# EAGLE schematic ProyectoFinal (EAGLE 9.4.0)
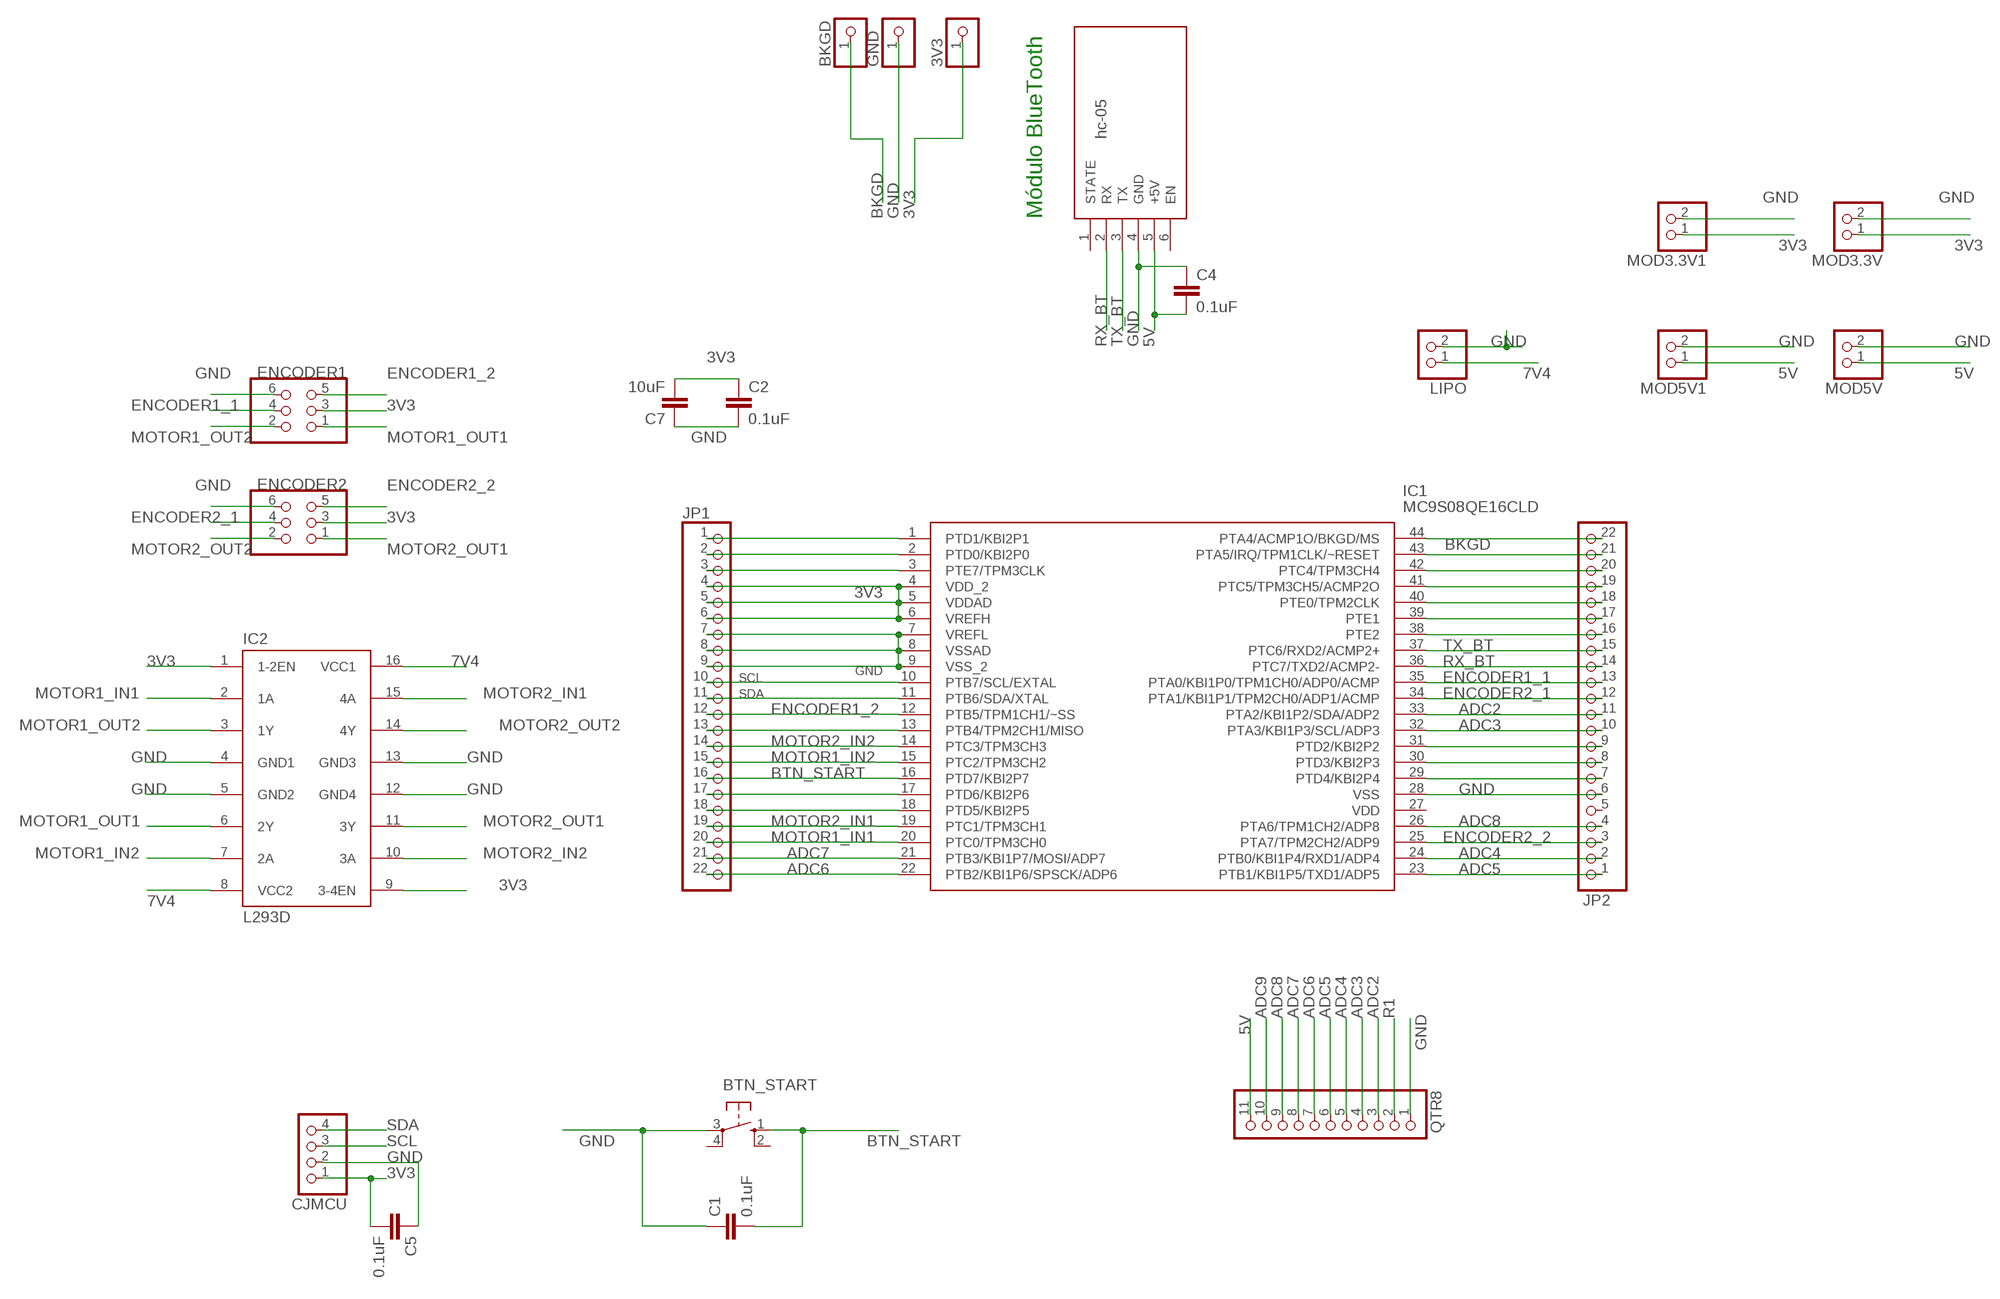
[diagram p0: schematic, sheet 1]

## Parts
3V3  PINHD-1X1  [1X01]
BKGD  PINHD-1X1  [1X01]
BLUETOOTH  hc-05  WIRELESS-BLUETOOTH-HC-05  [WIRELESS-BLUETOOTH-HC-05]
BTN_START  10-XX  [B3F-10XX]
C1  0.1uF  C-EUC0805K  [C0805K]
C2  0.1uF  C-EUC0805K  [C0805K]
C4  0.1uF  C-EUC0805K  [C0805K]
C5  0.1uF  C-EUC0805K  [C0805K]
C7  10uF  C-EUC1206K  [C1206K]
CJMCU  PINHD-1X4  [1X04]
ENCODER1  PINHD-2X3  [2X03]
ENCODER2  PINHD-2X3  [2X03]
GND  PINHD-1X1  [1X01]
IC1  MC9S08QE16CLD  [QFP80P1200X1200X160-44N]
IC2  L293D  [DIL16]
JP1  PINHD-1X22  [1X22]
JP2  PINHD-1X22  [1X22]
LIPO  PINHD-1X2  [1X02]
MOD3.3V  PINHD-1X2  [1X02]
MOD3.3V1  PINHD-1X2  [1X02]
MOD5V  PINHD-1X2  [1X02]
MOD5V1  PINHD-1X2  [1X02]
QTR8  PINHD-1X11  [1X11]

## Nets
3V3: 3V3.1 C2.1 C5.2 C7.2 CJMCU.1 ENCODER1.3 ENCODER2.3 IC1.4(VDD_2) IC1.5(VDDAD) IC1.6(VREFH) IC2.1(1-2EN) IC2.9(3-4EN) JP1.4 JP1.5 JP1.6 MOD3.3V1.1 MOD3.3V.1
5V: BLUETOOTH.5(+5V) C4.2 MOD5V1.1 MOD5V.1 QTR8.11
7V4: IC2.8(VCC2) IC2.16(VCC1) LIPO.1
ADC2: IC1.33(PTA2/KBI1P2/SDA/ADP2) JP2.11 QTR8.3
ADC3: IC1.32(PTA3/KBI1P3/SCL/ADP3) JP2.10 QTR8.4
ADC4: IC1.24(PTB0/KBI1P4/RXD1/ADP4) JP2.2 QTR8.5
ADC5: IC1.23(PTB1/KBI1P5/TXD1/ADP5) JP2.1 QTR8.6
ADC6: IC1.22(PTB2/KBI1P6/SPSCK/ADP6) JP1.22 QTR8.7
ADC7: IC1.21(PTB3/KBI1P7/MOSI/ADP7) JP1.21 QTR8.8
ADC8: IC1.26(PTA6/TPM1CH2/ADP8) JP2.4 QTR8.9
ADC9: QTR8.10
BKGD: BKGD.1 IC1.44(PTA4/ACMP1O/BKGD/MS) JP2.22
BTN_START: BTN_START.1(S) C1.2 IC1.16(PTD7/KBI2P7) JP1.16
ENCODER1_1: ENCODER1.4 IC1.35(PTA0/KBI1P0/TPM1CH0/ADP0/ACMP) JP2.13
ENCODER1_2: ENCODER1.5 IC1.12(PTB5/TPM1CH1/~SS) JP1.12
ENCODER2_1: ENCODER2.4 IC1.34(PTA1/KBI1P1/TPM2CH0/ADP1/ACMP) JP2.12
ENCODER2_2: ENCODER2.5 IC1.25(PTA7/TPM2CH2/ADP9) JP2.3
GND: BLUETOOTH.4(GND) BTN_START.3(P) C1.1 C2.2 C4.1 C5.1 C7.1 CJMCU.2 ENCODER1.6 ENCODER2.6 GND.1 IC1.7(VREFL) IC1.8(VSSAD) IC1.9(VSS_2) IC1.28(VSS) IC2.4(GND1) IC2.5(GND2) IC2.12(GND4) IC2.13(GND3) JP1.7 JP1.8 JP1.9 JP2.6 LIPO.2 MOD3.3V1.2 MOD3.3V.2 MOD5V1.2 MOD5V.2 QTR8.1
MOTOR1_IN1: IC1.20(PTC0/TPM3CH0) IC2.2(1A) JP1.20
MOTOR1_IN2: IC1.15(PTC2/TPM3CH2) IC2.7(2A) JP1.15
MOTOR1_OUT1: ENCODER1.1 IC2.6(2Y)
MOTOR1_OUT2: ENCODER1.2 IC2.3(1Y)
MOTOR2_IN1: IC1.19(PTC1/TPM3CH1) IC2.15(4A) JP1.19
MOTOR2_IN2: IC1.14(PTC3/TPM3CH3) IC2.10(3A) JP1.14
MOTOR2_OUT1: ENCODER2.1 IC2.11(3Y)
MOTOR2_OUT2: ENCODER2.2 IC2.14(4Y)
N$1: IC1.1(PTD1/KBI2P1) JP1.1
N$2: IC1.2(PTD0/KBI2P0) JP1.2
N$3: IC1.3(PTE7/TPM3CLK) JP1.3
N$13: IC1.13(PTB4/TPM2CH1/MISO) JP1.13
N$17: IC1.17(PTD6/KBI2P6) JP1.17
N$18: IC1.18(PTD5/KBI2P5) JP1.18
N$29: IC1.29(PTD4/KBI2P4) JP2.7
N$30: IC1.30(PTD3/KBI2P3) JP2.8
N$31: IC1.31(PTD2/KBI2P2) JP2.9
N$38: IC1.38(PTE2) JP2.16
N$39: IC1.39(PTE1) JP2.17
N$40: IC1.40(PTE0/TPM2CLK) JP2.18
N$41: IC1.41(PTC5/TPM3CH5/ACMP2O) JP2.19
N$42: IC1.42(PTC4/TPM3CH4) JP2.20
N$43: IC1.43(PTA5/IRQ/TPM1CLK/~RESET) JP2.21
R1: QTR8.2
RX_BT: BLUETOOTH.2(RX) IC1.36(PTC7/TXD2/ACMP2-) JP2.14
SCL: CJMCU.3 IC1.10(PTB7/SCL/EXTAL) JP1.10
SDA: CJMCU.4 IC1.11(PTB6/SDA/XTAL) JP1.11
TX_BT: BLUETOOTH.3(TX) IC1.37(PTC6/RXD2/ACMP2+) JP2.15
Unconnected: BLUETOOTH.1(STATE) BLUETOOTH.6(EN) BTN_START.2(S1) BTN_START.4(P1) IC1.27(VDD) JP2.5

## Notes on the sheet
- Módulo BlueTooth

## Library data of the parts
3V3 BKGD GND = pinhead:PINHD-1X1: PIN HEADER
BLUETOOTH = diy-modules:WIRELESS-BLUETOOTH-HC-05: Bluetooth Transceiver Module based on HC-05 board Tutorial is available here: https://arduino-info.wikispaces.com/BlueTooth-HC05-HC06-Modules-How-To Click here to find device on ebay.com <http://www.ebay.com/sch/hc-05+module+rs232>
BTN_START = switch-omron:10-XX: OMRON SWITCH; MPN: B3F-1000; OC_FARNELL: 176432; OC_NEWARK: 36M3542
C1 C2 C4 C5 C7 = rcl:C-EU: CAPACITOR, European symbol; SPICEPREFIX: C
CJMCU = pinhead:PINHD-1X4: PIN HEADER
ENCODER1 ENCODER2 = pinhead:PINHD-2X3: PIN HEADER
IC1 = MC9S08QE16CLD:MC9S08QE16CLD: Microcontrollers Source: Datasheet; DESCRIPTION: Microcontrollers; HEIGHT: mm; MANUFACTURER_NAME: Nexperia; MANUFACTURER_PART_NUMBER: MC9S08QE16CLD; MOUSER_PART_NUMBER: 841-MC9S08QE16CLD; MOUSER_PRICE-STOCK: https://www.mouser.com/Search/Refine.aspx?Keyword=841-MC9S08QE16CLD
IC2 = st-microelectronics:L293D: PUSH-PULL 4 CHANNEL DRIVER; MPN: L293D; OC_FARNELL: 9589619; OC_NEWARK: 56P8249
JP1 JP2 = pinhead:PINHD-1X22: PIN HEADER
LIPO MOD3.3V MOD3.3V1 MOD5V MOD5V1 = pinhead:PINHD-1X2: PIN HEADER
QTR8 = pinhead:PINHD-1X11: PIN HEADER